# EAGLE schematic NS_Integrator (EAGLE 9.5.1)

## Sheet 1 of 4
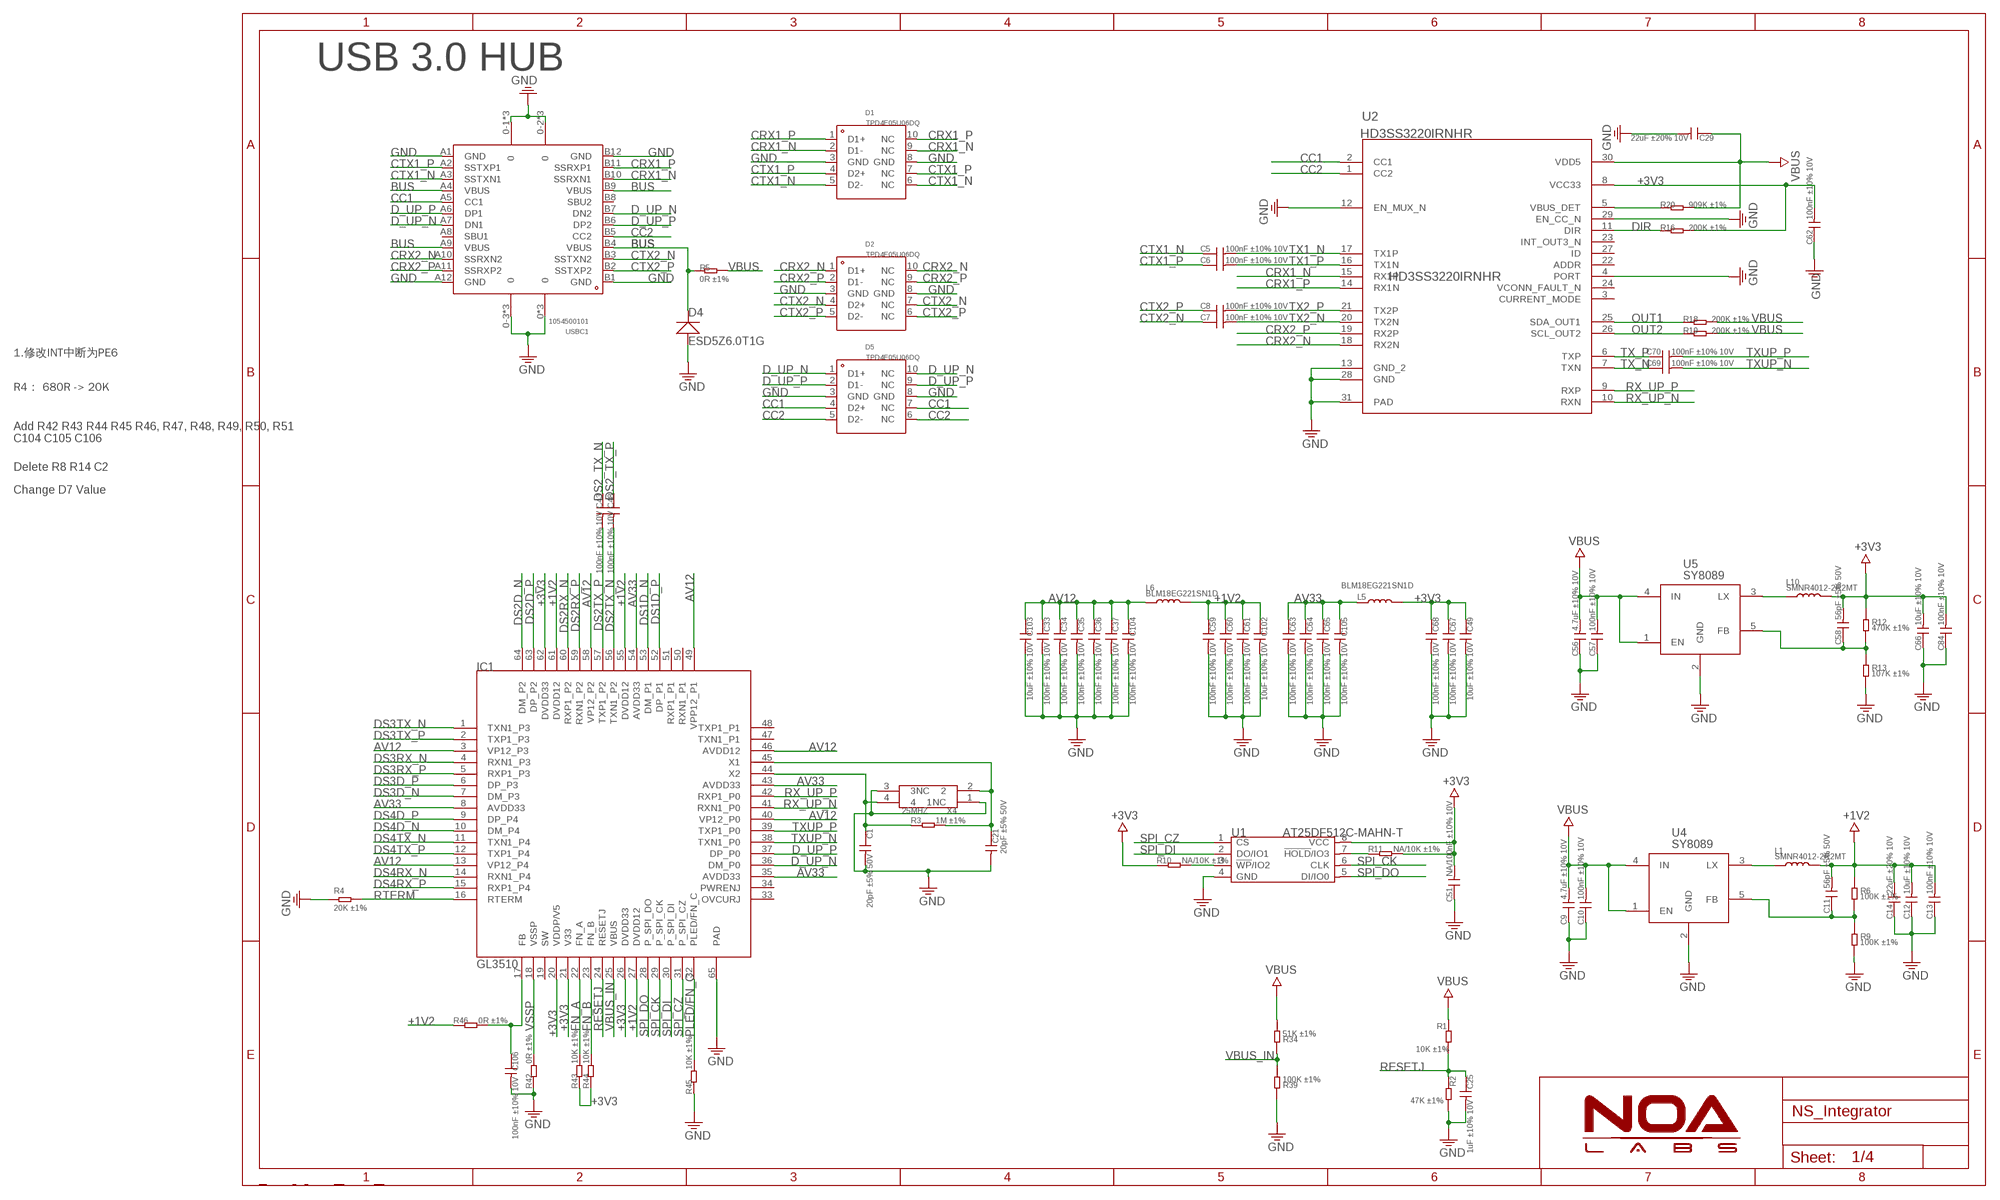
[diagram p0: schematic, sheet 1]

### Parts
C1  20pF ±5% 50V  C-0402  [C0402]
C5  100nF ±10% 10V  C-0201  [C0201]
C6  100nF ±10% 10V  C-0201  [C0201]
C7  100nF ±10% 10V  C-0201  [C0201]
C8  100nF ±10% 10V  C-0201  [C0201]
C9  4.7uF ±10% 10V  C-0603  [C0603]
C10  100nF ±10% 10V  C-0402  [C0402]
C11  56pF ±5% 50V  C-0402  [C0402]
C12  10uF ±10% 10V  C-0603  [C0603]
C13  100nF ±10% 10V  C-0402  [C0402]
C14  22uF ±20% 10V  C-0805  [C0805]
C21  20pF ±5% 50V  C-0402  [C0402]
C25  1uF ±10% 10V  C-0402  [C0402]
C29  22uF ±20% 10V  C-0805  [C0805]
C33  100nF ±10% 10V  C-0402  [C0402]
C34  100nF ±10% 10V  C-0402  [C0402]
C35  100nF ±10% 10V  C-0402  [C0402]
C36  100nF ±10% 10V  C-0402  [C0402]
C37  100nF ±10% 10V  C-0402  [C0402]
C43  100nF ±10% 10V  C-0201  [C0201]
C48  100nF ±10% 10V  C-0201  [C0201]
C49  10uF ±10% 10V  C-0603  [C0603]
C51  NA/100nF ±10% 10V  C-0402  [C0402]
C56  4.7uF ±10% 10V  C-0603  [C0603]
C57  100nF ±10% 10V  C-0402  [C0402]
C58  56pF ±5% 50V  C-0402  [C0402]
C59  100nF ±10% 10V  C-0402  [C0402]
C60  100nF ±10% 10V  C-0402  [C0402]
C61  100nF ±10% 10V  C-0402  [C0402]
C62  100nF ±10% 10V  C-0402  [C0402]
C63  100nF ±10% 10V  C-0402  [C0402]
C64  100nF ±10% 10V  C-0402  [C0402]
C65  100nF ±10% 10V  C-0402  [C0402]
C66  10uF ±10% 10V  C-0603  [C0603]
C67  100nF ±10% 10V  C-0402  [C0402]
C68  100nF ±10% 10V  C-0402  [C0402]
C69  100nF ±10% 10V  C-0201  [C0201]
C70  100nF ±10% 10V  C-0201  [C0201]
C84  100nF ±10% 10V  C-0402  [C0402]
C102  10uF ±10% 10V  C-0603  [C0603]
C103  10uF ±10% 10V  C-0603  [C0603]
C104  100nF ±10% 10V  C-0402  [C0402]
C105  100nF ±10% 10V  C-0402  [C0402]
C106  100nF ±10% 10V  C-0402  [C0402]
D1  TPD4E05U06DQ  TPD4E05U06DQARTPD4E05U06DQAR_C138714_USON-10_L2.5-W1.0-P0.50-BL  [USON-10_L2.5-W1.0-P0.50-BL]
D2  TPD4E05U06DQ  TPD4E05U06DQARTPD4E05U06DQAR_C138714_USON-10_L2.5-W1.0-P0.50-BL  [USON-10_L2.5-W1.0-P0.50-BL]
D4  ESD5Z6.0T1G  D-0603  [SOD523]
D5  TPD4E05U06DQ  TPD4E05U06DQARTPD4E05U06DQAR_C138714_USON-10_L2.5-W1.0-P0.50-BL  [USON-10_L2.5-W1.0-P0.50-BL]
IC1  GL3510  [QFN40P800X800X80-65N]
L1  SMNR4012-2R2MT  L-4012  [L4012]
L5  BLM18EG221SN1D  L-0603  [L0603]
L6  BLM18EG221SN1D  L-0603  [L0603]
L10  SMNR4012-2R2MT  L-4012  [L4012]
R1  10K ±1%  R-0402  [R0402]
R2  47K ±1%  R-0402  [R0402]
R3  1M ±1%  R-0402  [R0402]
R4  20K ±1%  R-0402  [R0402]
R5  0R ±1%  R-0805  [R0805]
R6  100K ±1%  R-0402  [R0402]
R9  100K ±1%  R-0402  [R0402]
R10  NA/10K ±1%  R-0402  [R0402]
R11  NA/10K ±1%  R-0402  [R0402]
R12  470K ±1%  R-0402  [R0402]
R13  107K ±1%  R-0402  [R0402]
R16  200K ±1%  R-0402  [R0402]
R18  200K ±1%  R-0402  [R0402]
R19  200K ±1%  R-0402  [R0402]
R20  909K ±1%  R-0402  [R0402]
R34  51K ±1%  R-0402  [R0402]
R39  100K ±1%  R-0402  [R0402]
R42  0R ±1%  R-0402  [R0402]
R43  10K ±1%  R-0402  [R0402]
R44  10K ±1%  R-0402  [R0402]
R45  10K ±1%  R-0402  [R0402]
R46  0R ±1%  R-0402  [R0402]
U1  AT25DF512C-MAHN-T  W25Q  [SOIC8-6.0]
U2  HD3SS3220IRNHR  [RNH0030A]
U4  SY8089  [SOT23-5]
U5  SY8089  [SOT23-5]
USBC1  1054500101  TYPEC-105450-0101105450-0101_USB-C-SMD_TYPE-C-USB-18  [USB-C-SMD_TYPE-C-USB-18]
X4  25MHZ  CRYSTAL-XTAL-4P  [4P-SMD-2X1.6MM]

### Nets
+1V2: C11.2 C12.2 C13.2 C14.2 C59.1 C60.1 C61.1 C102.1 IC1.27(DVDD12) IC1.55(DVDD12) IC1.61(DVDD12) L1.2 L6.2 R6.1 R46.1
+3V3: C49.1 C51.2 C58.2 C62.2 C66.2 C67.1 C68.1 C84.2 IC1.20(VDDP/V5) IC1.21(V33) IC1.26(DVDD33) IC1.62(DVDD33) L5.2 L10.2 R10.1 R11.2 R12.1 R16.2 R43.1 R44.1 U1.8(VCC) U2.8(VCC33) ; also sheet 2,3,4
AV12: C33.1 C34.1 C35.1 C36.1 C37.1 C103.1 C104.1 IC1.3(VP12_P3) IC1.13(VP12_P4) IC1.40(VP12_P0) IC1.46(AVDD12) IC1.49(VPP12_P1) IC1.58(VP12_P2) L6.1
AV33: C63.1 C64.1 C65.1 C105.1 IC1.8(AVDD33) IC1.35(AVDD33) IC1.43(AVDD33) IC1.54(AVDD33) L5.1
BUS: D4.- R5.1 USBC1.A4(VBUS) USBC1.A9(VBUS) USBC1.B4(VBUS) USBC1.B9(VBUS)
CC1: D5.4(D2+) D5.7(NC) U2.2(CC1) USBC1.A5(CC1)
CC2: D5.5(D2-) D5.6(NC) U2.1(CC2) USBC1.B5(CC2)
CRX1_N [Diff]: D1.2(D1-) D1.9(NC) U2.15(RX1P) USBC1.B10(SSRXN1)
CRX1_P [Diff]: D1.1(D1+) D1.10(NC) U2.14(RX1N) USBC1.B11(SSRXP1)
CRX2_N [Diff]: D2.1(D1+) D2.10(NC) U2.18(RX2N) USBC1.A10(SSRXN2)
CRX2_P [Diff]: D2.2(D1-) D2.9(NC) U2.19(RX2P) USBC1.A11(SSRXP2)
CTX1_N [Diff]: C5.1 D1.5(D2-) D1.6(NC) USBC1.A3(SSTXN1)
CTX1_P [Diff]: C6.1 D1.4(D2+) D1.7(NC) USBC1.A2(SSTXP1)
CTX2_N [Diff]: C7.1 D2.4(D2+) D2.7(NC) USBC1.B3(SSTXN2)
CTX2_P [Diff]: C8.1 D2.5(D2-) D2.6(NC) USBC1.B2(SSTXP2)
D_UP_N [Diff]: D5.1(D1+) D5.10(NC) IC1.36(DM_P0) USBC1.A7(DN1) USBC1.B7(DN2)
D_UP_P [Diff]: D5.2(D1-) D5.9(NC) IC1.37(DP_P0) USBC1.A6(DP1) USBC1.B6(DP2)
DIR: R16.1 U2.11(DIR)
DS1D_N [Diff]: IC1.53(DM_P1) ; also sheet 4
DS1D_P [Diff]: IC1.52(DP_P1) ; also sheet 4
DS2_TX_N [Diff]: C43.1 ; also sheet 2
DS2_TX_P [Diff]: C48.1 ; also sheet 2
DS2D_N [Diff]: IC1.64(DM_P2) ; also sheet 3,4
DS2D_P [Diff]: IC1.63(DP_P2) ; also sheet 3,4
DS2RX_N [Diff]: IC1.60(RXP1_P2) ; also sheet 2
DS2RX_P [Diff]: IC1.59(RXN1_P2) ; also sheet 2
DS2TX_N [Diff]: C48.2 IC1.56(TXN1_P2)
DS2TX_P [Diff]: C43.2 IC1.57(TXP1_P2)
DS3D_N [Diff]: IC1.7(DM_P3) ; also sheet 4
DS3D_P [Diff]: IC1.6(DP_P3) ; also sheet 4
DS3RX_N [Diff]: IC1.4(RXN1_P3) ; also sheet 4
DS3RX_P [Diff]: IC1.5(RXP1_P3) ; also sheet 4
DS3TX_N [Diff]: IC1.1(TXN1_P3) ; also sheet 4
DS3TX_P [Diff]: IC1.2(TXP1_P3) ; also sheet 4
DS4D_N [Diff]: IC1.10(DM_P4) ; also sheet 4
DS4D_P [Diff]: IC1.9(DP_P4) ; also sheet 4
DS4RX_N [Diff]: IC1.14(RXN1_P4) ; also sheet 4
DS4RX_P [Diff]: IC1.15(RXP1_P4) ; also sheet 4
DS4TX_N [Diff]: IC1.11(TXN1_P4) ; also sheet 4
DS4TX_P [Diff]: IC1.12(TXP1_P4) ; also sheet 4
FN_A: IC1.22(FN_A) R43.2
FN_B: IC1.23(FN_B) R44.2
GND: C1.2 C9.1 C10.1 C12.1 C13.1 C14.1 C21.2 C25.2 C29.2 C33.2 C34.2 C35.2 C36.2 C37.2 C49.2 C51.1 C56.1 C57.1 C59.2 C60.2 C61.2 C62.1 C63.2 C64.2 C65.2 C66.1 C67.2 C68.2 C84.1 C102.2 C103.2 C104.2 C105.2 C106.2 D1.3(GND) D1.8(GND) D2.3(GND) D2.8(GND) D4.+ D5.3(GND) D5.8(GND) IC1.65(PAD) R2.2 R4.1 R9.2 R13.2 R39.1 R42.1 R45.1 U1.4(GND) U2.4(PORT) U2.12(EN_MUX_N) U2.13(GND_2) U2.28(GND) U2.29(EN_CC_N) U2.31(PAD) U4.2(GND) U5.2(GND) USBC1.0 USBC1.0-1 USBC1.0-2 USBC1.0-3 USBC1.0-4 USBC1.0-5 USBC1.0-6 USBC1.0-7 USBC1.0-8 USBC1.0-9 USBC1.1 USBC1.2 USBC1.A1(GND) USBC1.A12(GND) USBC1.B1(GND) USBC1.B12(GND) X4.1(1NC) X4.3(3NC) ; also sheet 2,3,4
N$1: C1.1 IC1.44(X2) R3.1 X4.4
N$2: C106.1 IC1.17(FB) R46.2
N$3: C21.1 IC1.45(X1) R3.2 X4.2
N$4: C58.1 R12.2 R13.1 U5.5(FB)
N$6: L10.1 U5.3(LX)
N$7: C11.1 R6.2 R9.1 U4.5(FB)
N$9: L1.1 U4.3(LX)
N$16: R20.1 U2.5(VBUS_DET)
N$43: R10.2 U1.3(!WP!/IO2)
N$49: R11.1 U1.7(!HOLD!/IO3)
OUT1: R18.1 U2.25(SDA_OUT1)
OUT2: R19.1 U2.26(SCL_OUT2)
PLED/FN_C: IC1.32(PLED/FN_C) R45.2
RESETJ: C25.1 IC1.24(RESETJ) R1.2 R2.1
RTERM: IC1.16(RTERM) R4.2
RX_UP_N [Diff]: IC1.41(RXN1_P0) U2.10(RXN)
RX_UP_P [Diff]: IC1.42(RXP1_P0) U2.9(RXP)
SPI_CK: IC1.29(P_SPI_CK) U1.6(CLK)
SPI_CZ: IC1.31(P_SPI_CZ) U1.1(!CS)
SPI_DI: IC1.30(P_SPI_DI) U1.2(DO/IO1)
SPI_DO: IC1.28(P_SPI_DO) U1.5(DI/IO0)
TX1_N [Diff]: C5.2 U2.17(TX1P)
TX1_P [Diff]: C6.2 U2.16(TX1N)
TX2_N [Diff]: C7.2 U2.20(TX2N)
TX2_P [Diff]: C8.2 U2.21(TX2P)
TX_N [Diff]: C69.1 U2.7(TXN)
TX_P [Diff]: C70.1 U2.6(TXP)
TXUP_N [Diff]: C69.2 IC1.38(TXN1_P0)
TXUP_P [Diff]: C70.2 IC1.39(TXP1_P0)
VBUS: C9.2 C10.2 C29.1 C56.2 C57.2 R1.1 R5.2 R18.2 R19.2 R20.2 R34.2 U2.30(VDD5) U4.1(EN) U4.4(IN) U5.1(EN) U5.4(IN) ; also sheet 2,4
VBUS_IN: IC1.25(VBUS) R34.1 R39.2
VSSP: IC1.18(VSSP) R42.2
Unconnected: IC1.19(SW) IC1.33(OVCURJ) IC1.34(PWRENJ) IC1.47(TXN1_P1) IC1.48(TXP1_P1) IC1.50(RXN1_P1) IC1.51(RXP1_P1) U2.3(CURRENT_MODE) U2.22(ADDR) U2.23(INT_OUT3_N) U2.24(VCONN_FAULT_N) U2.27(ID) USBC1.A8(SBU1) USBC1.B8(SBU2)

### Notes on the sheet
- USB 3.0 HUB
- 1.修改INT中断为PE6
- R4： 680R -> 20K
- Add R42 R43 R44 R45 R46, R47, R48, R49, R50, R51
  C104 C105 C106
- Delete R8 R14 C2
- Change D7 Value

## Sheet 2 of 4
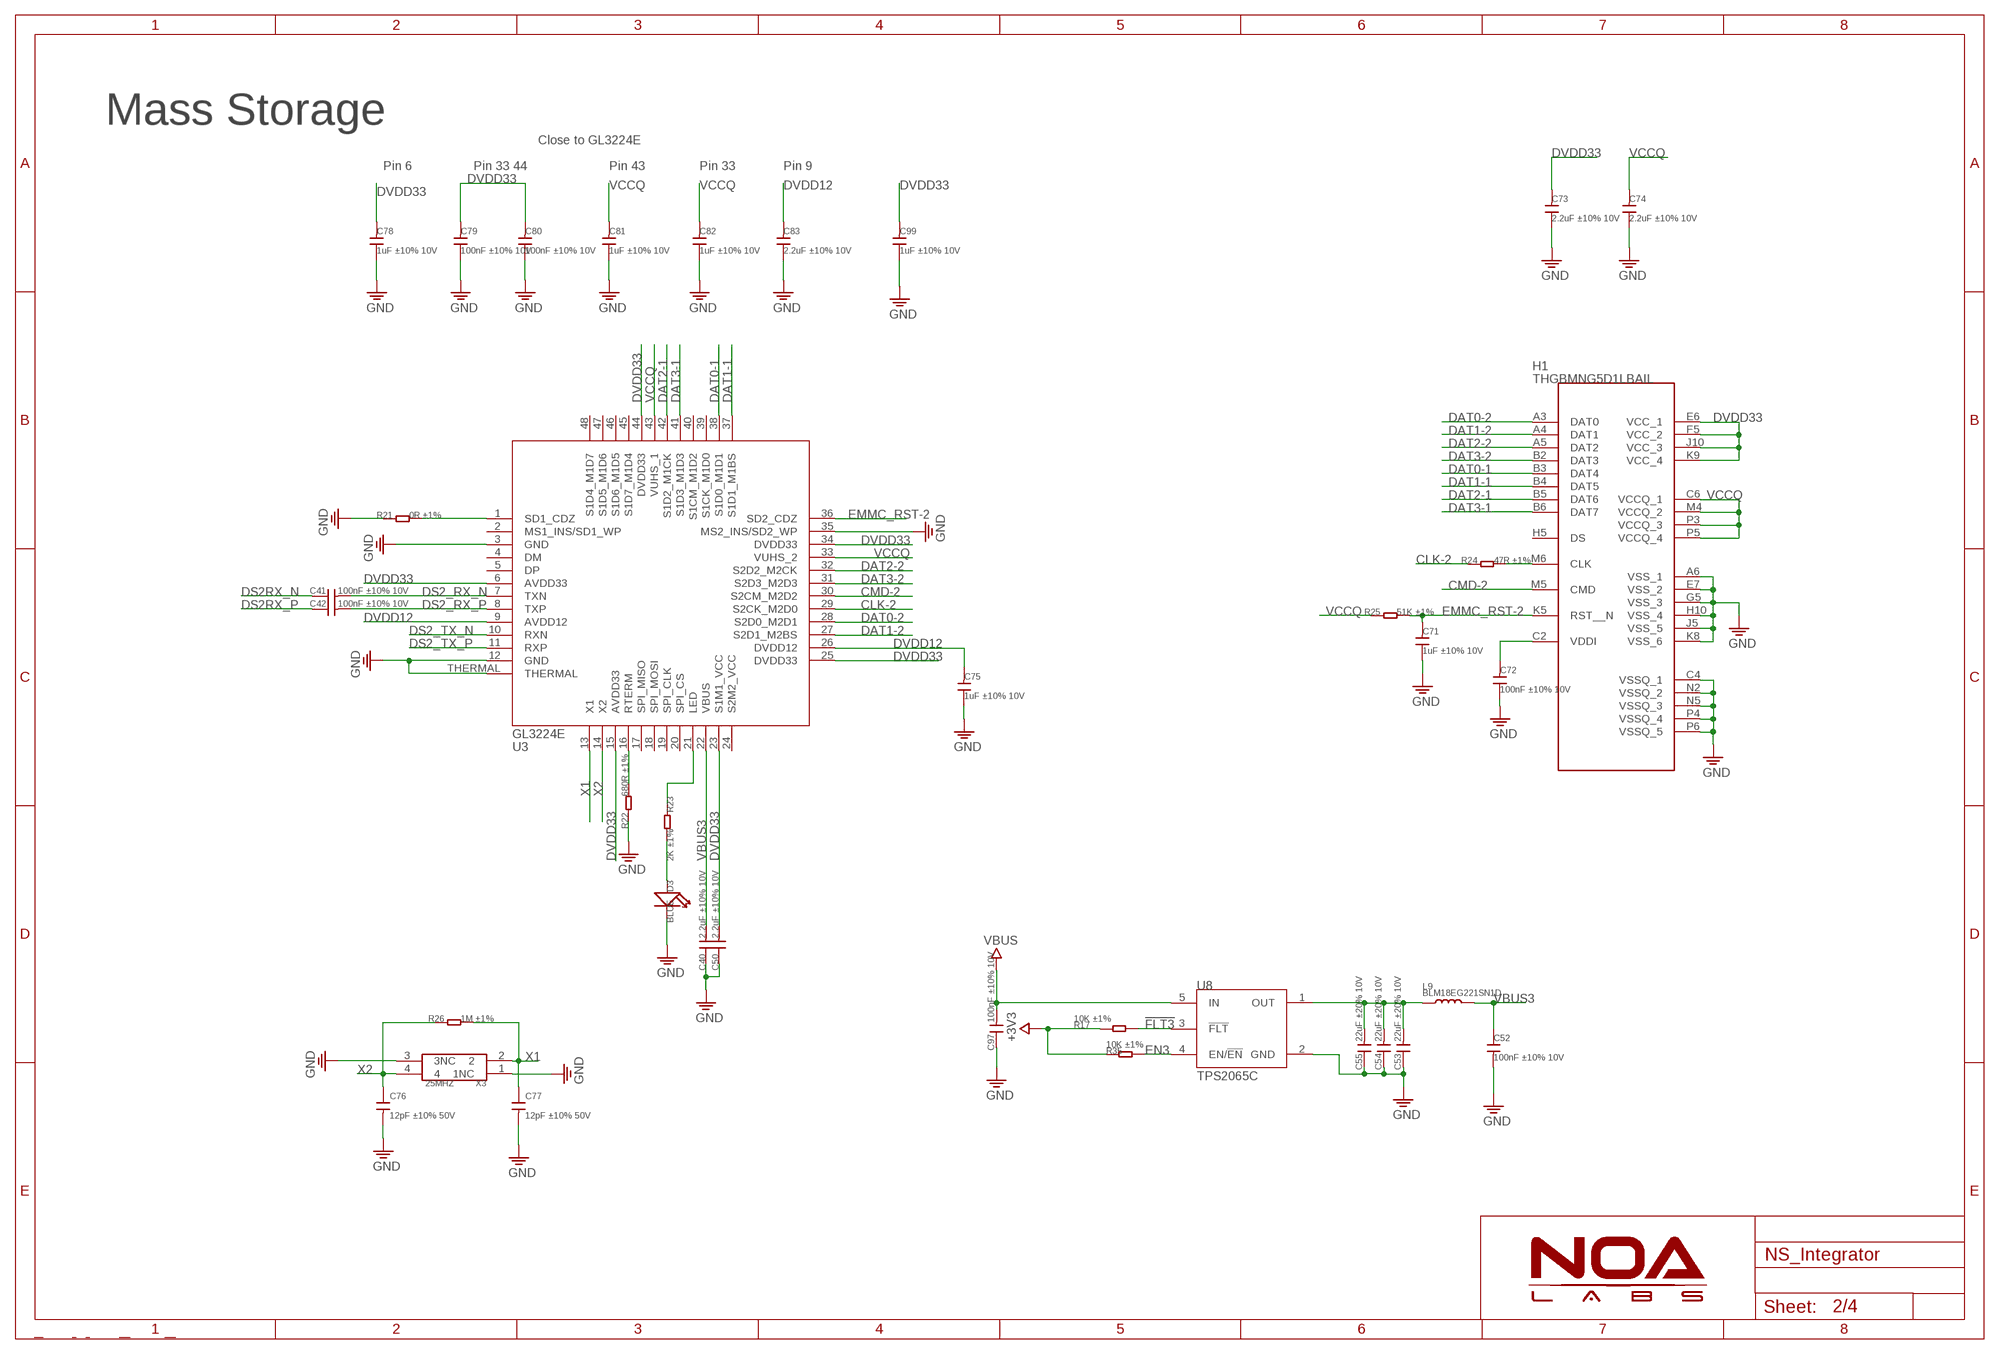
[diagram p1: schematic, sheet 2]

### Parts
C40  2.2uF ±10% 10V  C-0402  [C0402]
C41  100nF ±10% 10V  C-0201  [C0201]
C42  100nF ±10% 10V  C-0201  [C0201]
C50  2.2uF ±10% 10V  C-0402  [C0402]
C52  100nF ±10% 10V  C-0402  [C0402]
C53  22uF ±20% 10V  C-0603  [C0603]
C54  22uF ±20% 10V  C-0603  [C0603]
C55  22uF ±20% 10V  C-0603  [C0603]
C71  1uF ±10% 10V  C-0402  [C0402]
C72  100nF ±10% 10V  C-0402  [C0402]
C73  2.2uF ±10% 10V  C-0402  [C0402]
C74  2.2uF ±10% 10V  C-0402  [C0402]
C75  1uF ±10% 10V  C-0402  [C0402]
C76  12pF ±10% 50V  C-0402  [C0402]
C77  12pF ±10% 50V  C-0402  [C0402]
C78  1uF ±10% 10V  C-0402  [C0402]
C79  100nF ±10% 10V  C-0402  [C0402]
C80  100nF ±10% 10V  C-0402  [C0402]
C81  1uF ±10% 10V  C-0402  [C0402]
C82  1uF ±10% 10V  C-0402  [C0402]
C83  2.2uF ±10% 10V  C-0402  [C0402]
C97  100nF ±10% 10V  C-0402  [C0402]
C99  1uF ±10% 10V  C-0402  [C0402]
D3  BLUE  LED-0402LED  [0402_LED]
H1  THGBMNG5D1LBAIL  EMMC-SPECIALPAD  [BGA153C50P14X14_11.5X13]
L9  BLM18EG221SN1D  L-0603  [L0603]
R17  10K ±1%  R-0402  [R0402]
R21  0R ±1%  R-0402  [R0402]
R22  680R ±1%  R-0402  [R0402]
R23  2K ±1%  R-0402  [R0402]
R24  47R ±1%  R-0402  [R0402]
R25  51K ±1%  R-0402  [R0402]
R26  1M ±1%  R-0402  [R0402]
R35  10K ±1%  R-0402  [R0402]
U3  GL3224E  [TQFN48_7MM]
U8  TPS2065C  TPS20XXC  [SOT23-5]
X3  25MHZ  CRYSTAL-XTAL-4P  [4P-SMD-2X1.6MM]

### Nets
!FLT3: R17.2 U8.3(!FLT) ; also sheet 3
+3V3: R17.1 R35.1 ; also sheet 1,3,4
CLK-2: R24.1 U3.29(S2CK_M2D0)
CMD-2 [CMD]: H1.M5(CMD) U3.30(S2CM_M2D2)
DAT0-1 [DATA]: H1.B3(DAT4) U3.38(S1D0_M1D1)
DAT0-2 [DATA]: H1.A3(DAT0) U3.28(S2D0_M2D1)
DAT1-1 [DATA]: H1.B4(DAT5) U3.37(S1D1_M1BS)
DAT1-2 [DATA]: H1.A4(DAT1) U3.27(S2D1_M2BS)
DAT2-1 [DATA]: H1.B5(DAT6) U3.42(S1D2_M1CK)
DAT2-2 [DATA]: H1.A5(DAT2) U3.32(S2D2_M2CK)
DAT3-1 [DATA]: H1.B6(DAT7) U3.41(S1D3_M1D3)
DAT3-2 [DATA]: H1.B2(DAT3) U3.31(S2D3_M2D3)
DS2_RX_N [Diff]: C41.2 U3.7(TXN)
DS2_RX_P [Diff]: C42.2 U3.8(TXP)
DS2_TX_N [Diff]: U3.10(RXN) ; also sheet 1
DS2_TX_P [Diff]: U3.11(RXP) ; also sheet 1
DS2RX_N [Diff]: C41.1 ; also sheet 1
DS2RX_P [Diff]: C42.1 ; also sheet 1
DVDD12: C75.2 C83.2 U3.9(AVDD12) U3.26(DVDD12)
DVDD33: C50.2 C73.2 C78.2 C79.2 C80.2 C99.2 H1.E6(VCC_1) H1.F5(VCC_2) H1.J10(VCC_3) H1.K9(VCC_4) U3.6(AVDD33) U3.15(AVDD33) U3.23(S1M1_VCC) U3.25(DVDD33) U3.34(DVDD33) U3.44(DVDD33)
EMMC_RST-2: C71.2 H1.K5(RST__N) R25.2 U3.36(SD2_CDZ)
EN3: R35.2 U8.4(EN/!EN) ; also sheet 3
GND: C40.1 C50.1 C52.2 C53.1 C54.1 C55.1 C71.1 C72.1 C73.1 C74.1 C75.1 C76.2 C77.2 C78.1 C79.1 C80.1 C81.1 C82.1 C83.1 C97.1 C99.1 D3.2(-) H1.A6(VSS_1) H1.C4(VSSQ_1) H1.E7(VSS_2) H1.G5(VSS_3) H1.H10(VSS_4) H1.J5(VSS_5) H1.K8(VSS_6) H1.N2(VSSQ_2) H1.N5(VSSQ_3) H1.P4(VSSQ_4) H1.P6(VSSQ_5) R21.1 R22.1 U3.3(GND) U3.12(GND) U3.35(MS2_INS/SD2_WP) U3.THERMAL U8.2(GND) X3.1(1NC) X3.3(3NC) ; also sheet 1,3,4
N$10 [CLK]: H1.M6(CLK) R24.2
N$13: C72.2 H1.C2(VDDI)
N$15: C53.2 C54.2 C55.2 L9.1 U8.1(OUT)
N$23: R23.1 U3.21(LED)
N$26: D3.1(+) R23.2
N$32: R21.2 U3.1(SD1_CDZ)
N$68: R22.2 U3.16(RTERM)
VBUS: C97.2 U8.5(IN) ; also sheet 1,4
VBUS3: C40.2 C52.1 L9.2 U3.22(VBUS)
VCCQ: C74.2 C81.2 C82.2 H1.C6(VCCQ_1) H1.M4(VCCQ_2) H1.P3(VCCQ_3) H1.P5(VCCQ_4) R25.1 U3.33(VUHS_2) U3.43(VUHS_1)
X1: C77.1 R26.2 U3.13(X1) X3.2
X2: C76.1 R26.1 U3.14(X2) X3.4
Unconnected: H1.H5(DS) U3.2(MS1_INS/SD1_WP) U3.4(DM) U3.5(DP) U3.17(SPI_MISO) U3.18(SPI_MOSI) U3.19(SPI_CLK) U3.20(SPI_CS) U3.24(S2M2_VCC) U3.39(S1CK_M1D0) U3.40(S1CM_M1D2) U3.45(S1D7_M1D4) U3.46(S1D6_M1D5) U3.47(S1D5_M1D6) U3.48(S1D4_M1D7)

### Notes on the sheet
- Mass Storage
- Close to GL3224E
- Pin 6 | Pin 33 44 | Pin 43 | Pin 33 | Pin 9

## Sheet 3 of 4
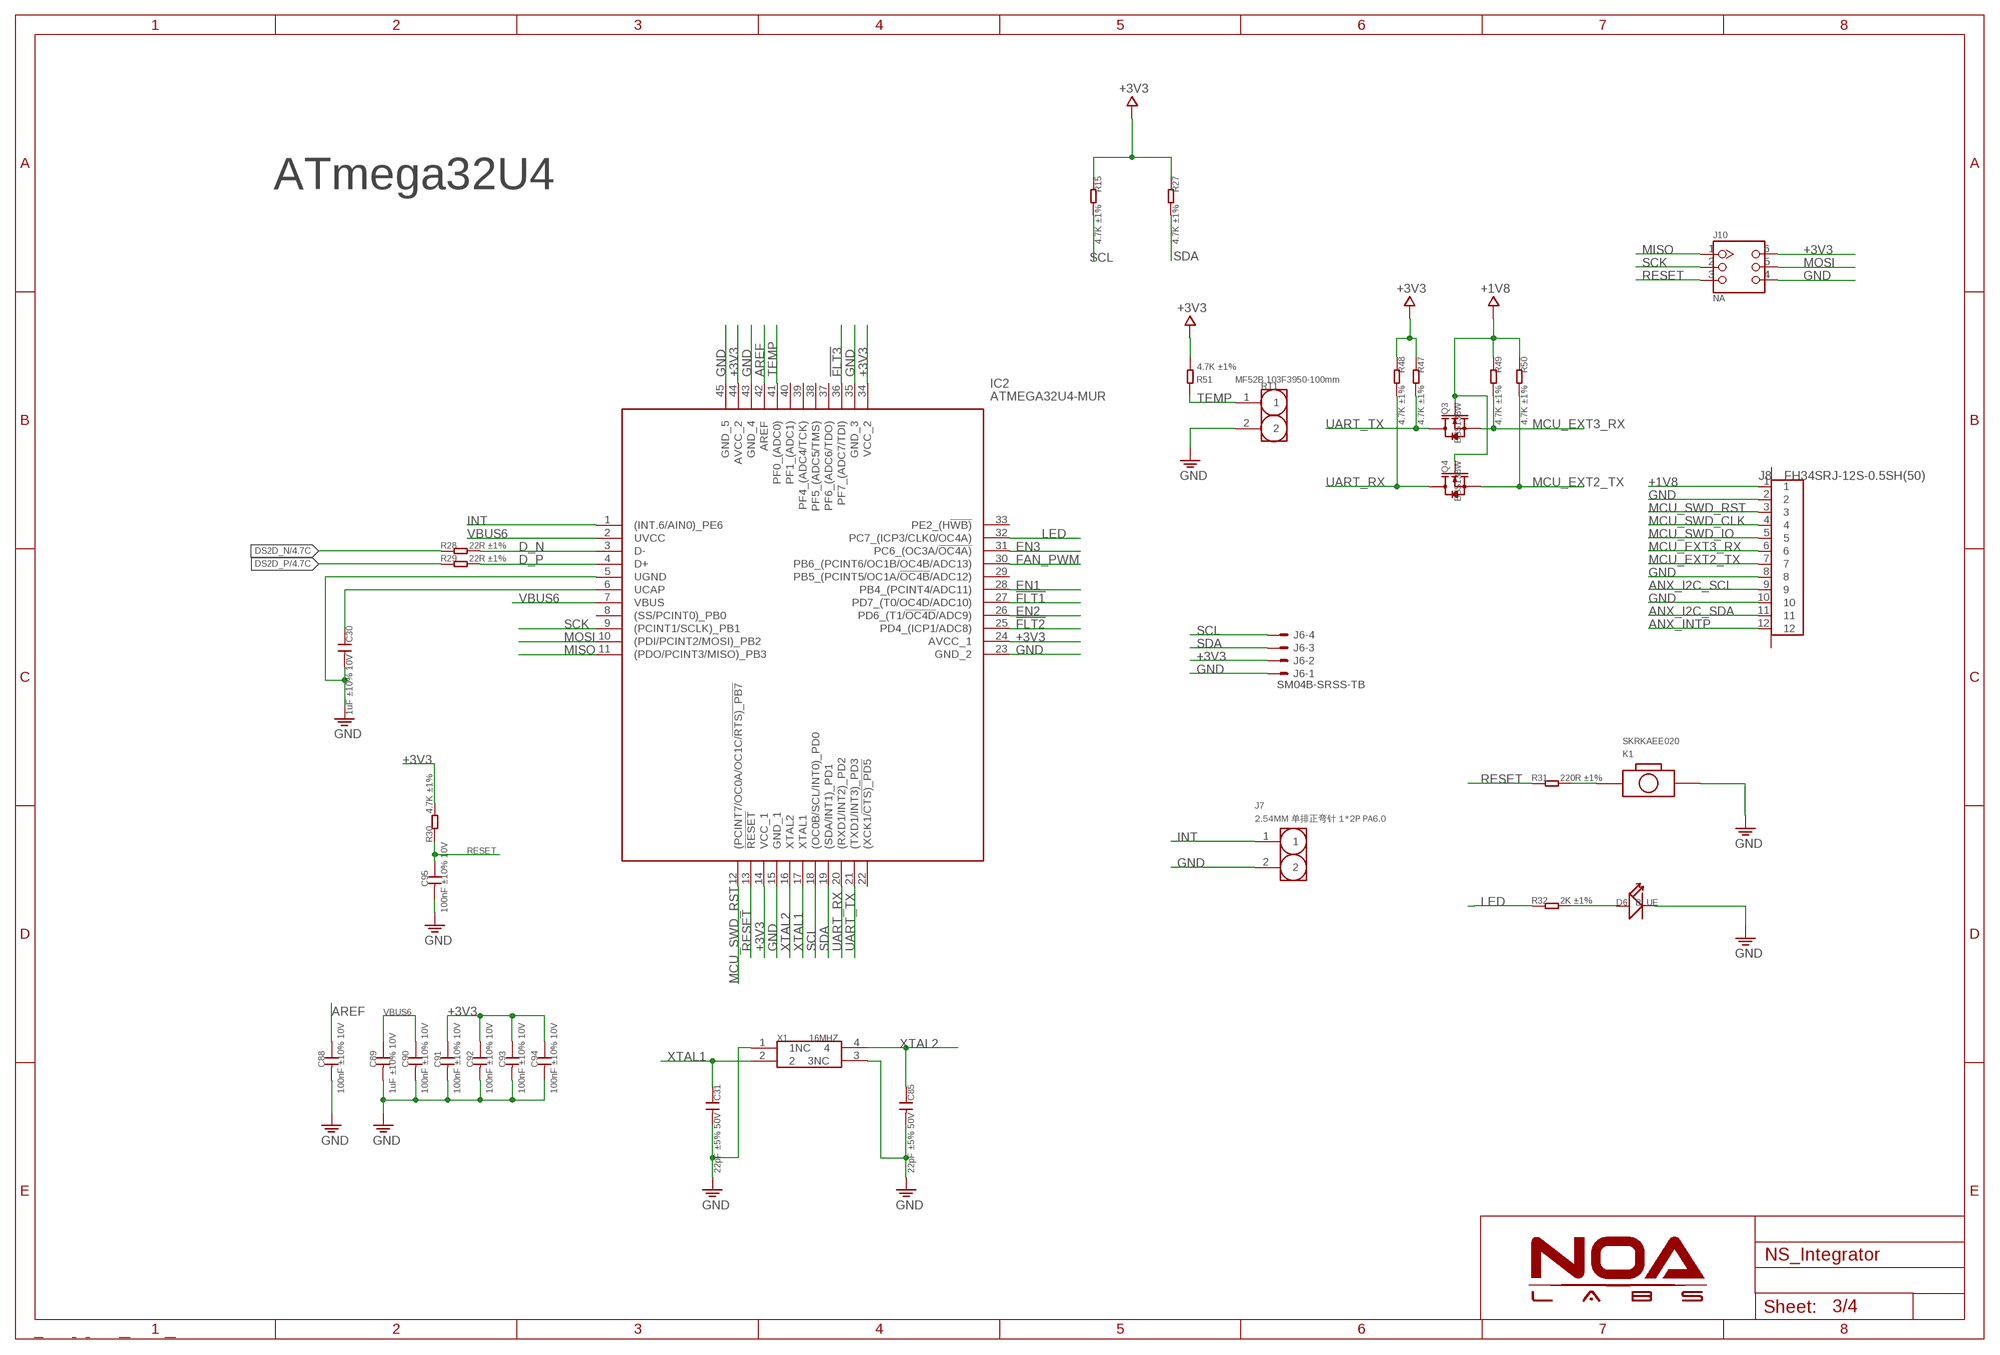
[diagram p2: schematic, sheet 3]

### Parts
C30  1uF ±10% 10V  C-0402  [C0402]
C31  22pF ±5% 50V  C-0402  [C0402]
C85  22pF ±5% 50V  C-0402  [C0402]
C88  100nF ±10% 10V  C-0402  [C0402]
C89  1uF ±10% 10V  C-0402  [C0402]
C90  100nF ±10% 10V  C-0402  [C0402]
C91  100nF ±10% 10V  C-0402  [C0402]
C92  100nF ±10% 10V  C-0402  [C0402]
C93  100nF ±10% 10V  C-0402  [C0402]
C94  100nF ±10% 10V  C-0402  [C0402]
C95  100nF ±10% 10V  C-0402  [C0402]
D6  BLUE  LED-0402LED  [0402_LED]
IC2  ATMEGA32U4-MUR  ATMEGA32U4-MU  [QFN50P700X700X100-45N]
J6  SM04B-SRSS-TB  [SM04B-SRSS-TB]
J7  2.54MM 单排正弯针 1*2P PA6.0  HEADER-2P-65/35MIL  [2P-2.54-65/35MIL]
J8  FH34SRJ-12S-0.5SH(50)  FPC-0.5-12PFPC-0.5-12P  [FPC-0.5-12P]
J10  NA  HEADER-2X3P-THT  [2X3P-2.54-65/35MIL]
K1  SKRKAEE020  BUTTON-2PSKRKAEE020  [SKRKAEE020]
Q3  BSS138W  MOSFET-N-323  [SOT-323]
Q4  BSS138W  MOSFET-N-323  [SOT-323]
R15  4.7K ±1%  R-0402  [R0402]
R27  4.7K ±1%  R-0402  [R0402]
R28  22R ±1%  R-0402  [R0402]
R29  22R ±1%  R-0402  [R0402]
R30  4.7K ±1%  R-0402  [R0402]
R31  220R ±1%  R-0402  [R0402]
R32  2K ±1%  R-0402  [R0402]
R47  4.7K ±1%  R-0402  [R0402]
R48  4.7K ±1%  R-0402  [R0402]
R49  4.7K ±1%  R-0402  [R0402]
R50  4.7K ±1%  R-0402  [R0402]
R51  4.7K ±1%  R-0402  [R0402]
RT1  MF52B 103F3950-100mm  HEADER-2P-1.27  [2P-1.27]
X1  16MHZ  CRYSTAL-XTAL-4P-3225  [4P-SMD-3.2X2.5]

### Nets
!FLT1: IC2.27(PD7_(T0/OC4D/ADC10)) ; also sheet 4
!FLT2: IC2.25(PD4_(ICP1/ADC8)) ; also sheet 4
!FLT3: IC2.36(PF7_(ADC7/TDI)) ; also sheet 2
+1V8: J8.1 Q3.1(G) Q4.1(G) R49.1 R50.1
+3V3: C91.1 C92.1 C93.1 C94.1 IC2.14(VCC_1) IC2.24(AVCC_1) IC2.34(VCC_2) IC2.44(AVCC_2) J6.2 J10.6 R15.1 R27.1 R30.2 R47.1 R48.1 R51.1 ; also sheet 1,2,4
ANX_I2C_SCL: J8.9
ANX_I2C_SDA: J8.11
ANX_INTP: J8.12
AREF: C88.1 IC2.42(AREF)
D_N [Diff]: IC2.3(D-) R28.2
D_P [Diff]: IC2.4(D+) R29.2
DS2D_N [Diff]: R28.1 ; also sheet 1,4
DS2D_P [Diff]: R29.1 ; also sheet 1,4
EN1: IC2.28(PB4_(PCINT4/ADC11)) ; also sheet 4
EN2: IC2.26(PD6_(T1/!OC4D!/ADC9)) ; also sheet 4
EN3: IC2.31(PC6_(OC3A/!OC4A)) ; also sheet 2
FAN_PWM: IC2.30(PB6_(PCINT6/OC1B/OC4B/ADC13)) ; also sheet 4
GND: C30.2 C31.2 C85.2 C88.2 C89.2 C90.2 C91.2 C92.2 C93.2 C94.2 C95.2 D6.2(-) IC2.5(UGND) IC2.15(GND_1) IC2.23(GND_2) IC2.35(GND_3) IC2.43(GND_4) IC2.45(GND_5) J6.1 J7.2 J8.2 J8.8 J8.10 J10.4 K1.2 RT1.2 X1.1(1NC) X1.3(3NC) ; also sheet 1,2,4
INT: IC2.1((INT.6/AIN0)_PE6) J7.1
LED: IC2.32(PC7_(ICP3/CLK0/OC4A)) R32.1
MCU_EXT2_TX: J8.7 Q4.2(S) R50.2
MCU_EXT3_RX: J8.6 Q3.2(S) R49.2
MCU_SWD_CLK: J8.4
MCU_SWD_IO: J8.5
MCU_SWD_RST: IC2.12((PCINT7/OC0A/OC1C/!RTS)_PB7) J8.3
MISO: IC2.11((PDO/PCINT3/MISO)_PB3) J10.1
MOSI: IC2.10((PDI/PCINT2/MOSI)_PB2) J10.5
N$11: C30.1 IC2.6(UCAP)
N$12: K1.1 R31.2
N$14: D6.1(+) R32.2
RESET: C95.1 IC2.13(!RESET) J10.3 R30.1 R31.1
SCK: IC2.9((PCINT1/SCLK)_PB1) J10.2
SCL: IC2.18((OC0B/SCL/INT0)_PD0) J6.4 R15.2
SDA: IC2.19((SDA/INT1)_PD1) J6.3 R27.2
TEMP: IC2.41(PF0_(ADC0)) R51.2 RT1.1
UART_RX: IC2.20((RXD1/INT2)_PD2) Q4.3(D) R48.2
UART_TX: IC2.21((TXD1/INT3)_PD3) Q3.3(D) R47.2
VBUS6: C89.1 C90.1 IC2.2(UVCC) IC2.7(VBUS) ; also sheet 4
XTAL1: C31.1 IC2.17(XTAL1) X1.2
XTAL2: C85.1 IC2.16(XTAL2) X1.4
Unconnected: IC2.8((SS/PCINT0)_PB0) IC2.22((XCK1/!CTS)_PD5) IC2.29(PB5_(PCINT5/OC1A/!OC4B!/ADC12)) IC2.33(PE2_(H!WB)) IC2.37(PF6_(ADC6/TDO)) IC2.38(PF5_(ADC5/TMS)) IC2.39(PF4_(ADC4/TCK)) IC2.40(PF1_(ADC1)) J8.P$13(G1) J8.P$14(G2)

### Notes on the sheet
- ATmega32U4

## Sheet 4 of 4
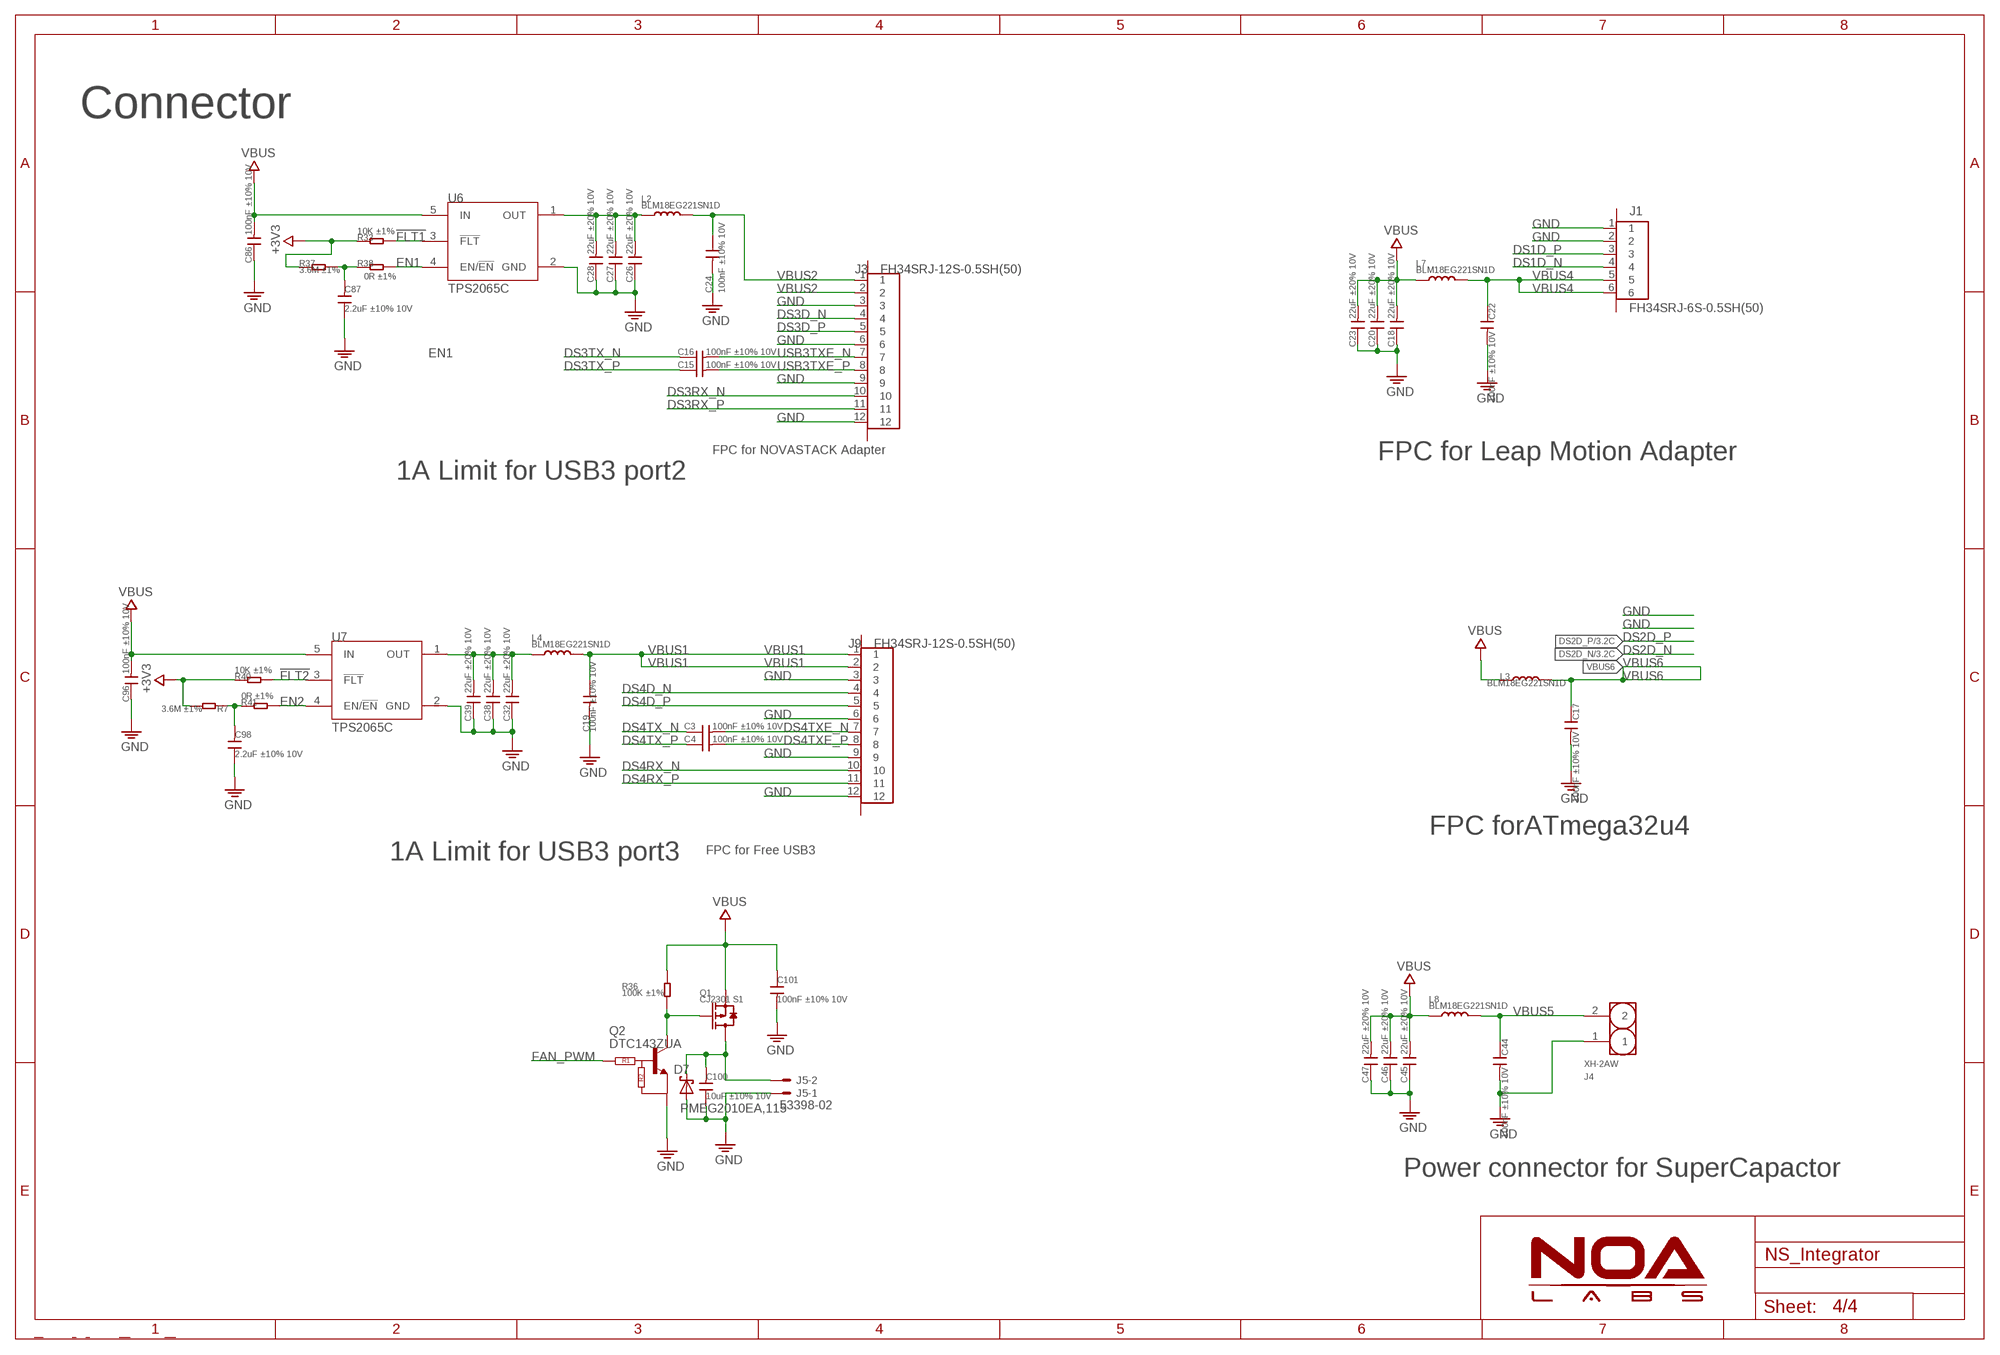
[diagram p3: schematic, sheet 4]

### Parts
C3  100nF ±10% 10V  C-0201  [C0201]
C4  100nF ±10% 10V  C-0201  [C0201]
C15  100nF ±10% 10V  C-0201  [C0201]
C16  100nF ±10% 10V  C-0201  [C0201]
C17  100nF ±10% 10V  C-0402  [C0402]
C18  22uF ±20% 10V  C-0603  [C0603]
C19  100nF ±10% 10V  C-0402  [C0402]
C20  22uF ±20% 10V  C-0603  [C0603]
C22  100nF ±10% 10V  C-0402  [C0402]
C23  22uF ±20% 10V  C-0603  [C0603]
C24  100nF ±10% 10V  C-0402  [C0402]
C26  22uF ±20% 10V  C-0603  [C0603]
C27  22uF ±20% 10V  C-0603  [C0603]
C28  22uF ±20% 10V  C-0603  [C0603]
C32  22uF ±20% 10V  C-0603  [C0603]
C38  22uF ±20% 10V  C-0603  [C0603]
C39  22uF ±20% 10V  C-0603  [C0603]
C44  100nF ±10% 10V  C-0402  [C0402]
C45  22uF ±20% 10V  C-0603  [C0603]
C46  22uF ±20% 10V  C-0603  [C0603]
C47  22uF ±20% 10V  C-0603  [C0603]
C86  100nF ±10% 10V  C-0402  [C0402]
C87  2.2uF ±10% 10V  C-0402  [C0402]
C96  100nF ±10% 10V  C-0402  [C0402]
C98  2.2uF ±10% 10V  C-0402  [C0402]
C100  10uF ±10% 10V  C-0603  [C0603]
C101  100nF ±10% 10V  C-0402  [C0402]
D7  PMEG2010EA,115  SCHOTTKY-SOD323  [SOD323]
J1  FH34SRJ-6S-0.5SH(50)  FPC-0.5-6P-FH34RJ  [FH34RJ-6S]
J3  FH34SRJ-12S-0.5SH(50)  FPC-0.5-12PFPC-0.5-12P  [FPC-0.5-12P]
J4  XH-2AW  HEADER-2P-90DEG-FEMALE  [XH-02-90]
J5  53398-02  [53398-02]
J9  FH34SRJ-12S-0.5SH(50)  FPC-0.5-12PFPC-0.5-12P  [FPC-0.5-12P]
L2  BLM18EG221SN1D  L-0603  [L0603]
L3  BLM18EG221SN1D  L-0603  [L0603]
L4  BLM18EG221SN1D  L-0603  [L0603]
L7  BLM18EG221SN1D  L-0603  [L0603]
L8  BLM18EG221SN1D  L-0603  [L0603]
Q1  CJ2301 S1  MOSFET-P-SOT23  [SOT23]
Q2  DTC143ZUA  DIGITAL-NPNEU  [SOT323]
R7  3.6M ±1%  R-0402  [R0402]
R33  10K ±1%  R-0402  [R0402]
R36  100K ±1%  R-0402  [R0402]
R37  3.6M ±1%  R-0402  [R0402]
R38  0R ±1%  R-0402  [R0402]
R40  10K ±1%  R-0402  [R0402]
R41  0R ±1%  R-0402  [R0402]
U6  TPS2065C  TPS20XXC  [SOT23-5]
U7  TPS2065C  TPS20XXC  [SOT23-5]

### Nets
!FLT1: R33.2 U6.3(!FLT) ; also sheet 3
!FLT2: R40.2 U7.3(!FLT) ; also sheet 3
+3V3: R7.1 R33.1 R37.2 R40.1 ; also sheet 1,2,3
DS1D_N [Diff]: J1.4 ; also sheet 1
DS1D_P [Diff]: J1.3 ; also sheet 1
DS3D_N [Diff]: J3.4 ; also sheet 1
DS3D_P [Diff]: J3.5 ; also sheet 1
DS3RX_N [Diff]: J3.10 ; also sheet 1
DS3RX_P [Diff]: J3.11 ; also sheet 1
DS3TX_N [Diff]: C16.1 ; also sheet 1
DS3TX_P [Diff]: C15.1 ; also sheet 1
DS4D_N [Diff]: J9.4 ; also sheet 1
DS4D_P [Diff]: J9.5 ; also sheet 1
DS4RX_N [Diff]: J9.10 ; also sheet 1
DS4RX_P [Diff]: J9.11 ; also sheet 1
DS4TX_N [Diff]: C3.1 ; also sheet 1
DS4TX_P [Diff]: C4.1 ; also sheet 1
DS4TXE_N [Diff]: C3.2 J9.7
DS4TXE_P [Diff]: C4.2 J9.8
EN1: R38.1 U6.4(EN/!EN) ; also sheet 3
EN2: R41.2 U7.4(EN/!EN) ; also sheet 3
FAN_PWM: Q2.1(INPUT) ; also sheet 3
GND: C17.2 C18.1 C19.2 C20.1 C22.2 C23.1 C24.2 C26.1 C27.1 C28.1 C32.1 C38.1 C39.1 C44.2 C45.1 C46.1 C47.1 C86.1 C87.1 C96.1 C98.1 C100.1 C101.2 D7.+(A) J1.1 J1.2 J3.3 J3.6 J3.9 J3.12 J4.1 J5.1 J9.3 J9.6 J9.9 J9.12 Q2.2(E) U6.2(GND) U7.2(GND) ; also sheet 1,2,3
N$5: C98.2 R7.2 R41.1
N$18: Q1.1(G) Q2.3(C) R36.1
N$20: C26.2 C27.2 C28.2 L2.1 U6.1(OUT)
N$21: C87.2 R37.1 R38.2
N$22: C32.2 C38.2 C39.2 L4.1 U7.1(OUT)
N$24: C100.2 D7.-(C) J5.2 Q1.3(D)
USB3TXE_N [Diff]: C16.2 J3.7
USB3TXE_P [Diff]: C15.2 J3.8
VBUS: C18.2 C20.2 C23.2 C45.2 C46.2 C47.2 C86.2 C96.2 C101.1 L3.1 L7.1 L8.1 Q1.2(S) R36.2 U6.5(IN) U7.5(IN) ; also sheet 1,2
VBUS1: C19.1 J9.1 J9.2 L4.2
VBUS2: C24.1 J3.1 J3.2 L2.2
VBUS4: C22.1 J1.5 J1.6 L7.2
VBUS5: C44.1 J4.2 L8.2
VBUS6: C17.1 L3.2 ; also sheet 3
Unconnected: J1.MH1(G1) J1.MH2(G2) J3.P$13(G1) J3.P$14(G2) J9.P$13(G1) J9.P$14(G2)

### Notes on the sheet
- Connector
- FPC for NOVASTACK Adapter
- FPC for Leap Motion Adapter
- 1A Limit for USB3 port2
- FPC forATmega32u4
- FPC for Free USB3
- 1A Limit for USB3 port3
- Power connector for SuperCapactor

## Library data of the parts
C1 C3-C106 = RCL:C
D1 D2 D5 = IC_NOA:TPD4E05U06DQAR: No description set; BOM_MANUFACTURER: TI; BOM_MANUFACTURER_PART: TPD4E05U06DQAR; BOM_SUPPLIER: LCSC; BOM_SUPPLIER_PART: C138714; CONTRIBUTOR: LCSC; SPICEPRE: D; SPICESYMBOLNAME: TPD4E05U06DQAR_C138714
D3 D6 = Discrete_NOA:LED*
D4 = Discrete_NOA:D*
D7 = Discrete_NOA:SCHOTTKY
H1 = IS21ES04G-JCLI-TR:EMMC-SPECIALPAD: eMMC 4 GB, 153 Ball FBGA, 3.3V, RoHS, T&R Source: Datasheet <https://componentsearchengine.com/Datasheets/1/IS21ES04G-JCLI-TR.pdf>; DESCRIPTION: eMMC 4 GB, 153 Ball FBGA, 3.3V, RoHS, T&R; HEIGHT: 1mm; MANUFACTURER_NAME: Integrated Silicon Solution Inc.; MANUFACTURER_PART_NUMBER: IS21ES04G-JCLI-TR; MOUSER_PART_NUMBER: 870-IS21ES04GJCLITR; MOUSER_PRICE-STOCK: https://www.mouser.com/Search/Refine.aspx?Keyword=870-IS21ES04GJCLITR
IC1 = IC_NOA:GL3510
IC2 = IC_NOA:ATMEGA32U4-MU: MCU 8-bit ATmega AVR RISC 32KB Flash Atmel ATMEGA32U4-MU, 8bit AVR Microcontroller, 16MHz, 32 kB Flash, 44-Pin QFN Source: Datasheet <https://componentsearchengine.com/Datasheets/2/ATMEGA32U4-MU.pdf>; DESCRIPTION: MCU 8-bit ATmega AVR RISC 32KB Flash Atmel ATMEGA32U4-MU, 8bit AVR Microcontroller, 16MHz, 32 kB Flash, 44-Pin QFN; HEIGHT: 1mm; MANUFACTURER_NAME: Microchip; MANUFACTURER_PART_NUMBER: ATMEGA32U4-MU; MOUSER_PART_NUMBER: 556-ATMEGA32U4-MU; MOUSER_PRICE-STOCK: https://www.mouser.com/Search/Refine.aspx?Keyword=556-ATMEGA32U4-MU; RS_PART_NUMBER: 1310290P; RS_PRICE-STOCK: http://uk.rs-online.com/web/p/products/1310290P
J1 = Connector_NOA:FPC-0.5-6P
J3 J8 J9 = Connector_NOA:FPC-0.5-12P
J4 J7 RT1 = Connector_NOA:HEADER-2P
J5 = con-molex:53?-02: CONNECTOR wire to board 1.25 mm (.049 inch) pitch header; MF: MOLEX; OC_FARNELL: unknown; OC_NEWARK: unknown
J6 = Connector_NOA:?M04B-SRSS-TB: Disconnectable Crimp style connector, 1.0mm pitch 4 contacts
J10 = Connector_NOA:HEADER-2X3P
K1 = Discrete_NOA:BUTTON-2P
L1-L10 = RCL:L
Q1 = Discrete_NOA:MOSFET-P
Q2 = Discrete_NOA:DIGITAL-NPN: NPN Resistor-Equipped Transistor (RET) family in small Surface-Mounted Device (SMD) plastic packages. AAL Eindhoven MK
Q3 Q4 = Discrete_NOA:MOSFET-N
R1-R7 R9-R13 R15-R51 = RCL:R
U1 = IC_NOA:W25Q: http://www.winbond.com.tw/NR/rdonlyres/EE30B34B-8D95-4519-84F4-428F2515F06D/0/SerialFlashSelectionGuide1112911.pdf
U2 = IC_NOA:HD3SS3220IRNHR; MANUFACTURER: Texas Instruments; PARTNUMBER: HD3SS3220IRNHR; REFDES: RefDes; TYPE: TYPE; VALUE: Value
U3 = IC_NOA:GL3224E
U4 U5 = IC_NOA:SY8089
U6-U8 = IC_NOA:TPS20XXC
USBC1 = Connector_NOA:TYPEC-105450-0101: No description set; BOM_MANUFACTURER: MOLEX; BOM_MANUFACTURER_PART: 105450-0101; BOM_SUPPLIER: LCSC; BOM_SUPPLIER_PART: C134092; CONTRIBUTOR: LCSC; SPICEPRE: U; SPICESYMBOLNAME: 105450-0101
X1 X3 X4 = Discrete_NOA:CRYSTAL-XTAL-4P

## Net classes
0 Normal: width 0.102 mm, drill 0.2 mm, clearance 0.102 mm
1 DATA: width 0.147 mm, drill 0.2 mm, clearance 0.305 mm to class 0, clearance 0.305 mm
2 Diff: width 0.117 mm, drill 0.2 mm, clearance 0.305 mm to class 0, clearance 0.305 mm to class 1, clearance 0.102 mm
3 CLK: width 0.147 mm, drill 0.2 mm, clearance 0.61 mm to class 0, clearance 0.61 mm to class 1, clearance 0.61 mm to class 2, clearance 0.61 mm
4 CMD: width 0.147 mm, drill 0.2 mm, clearance 0.457 mm to class 0, clearance 0.457 mm to class 1, clearance 0.457 mm to class 2, clearance 0.457 mm to class 3, clearance 0.457 mm